# Altium project 超声波测距.PrjPCB
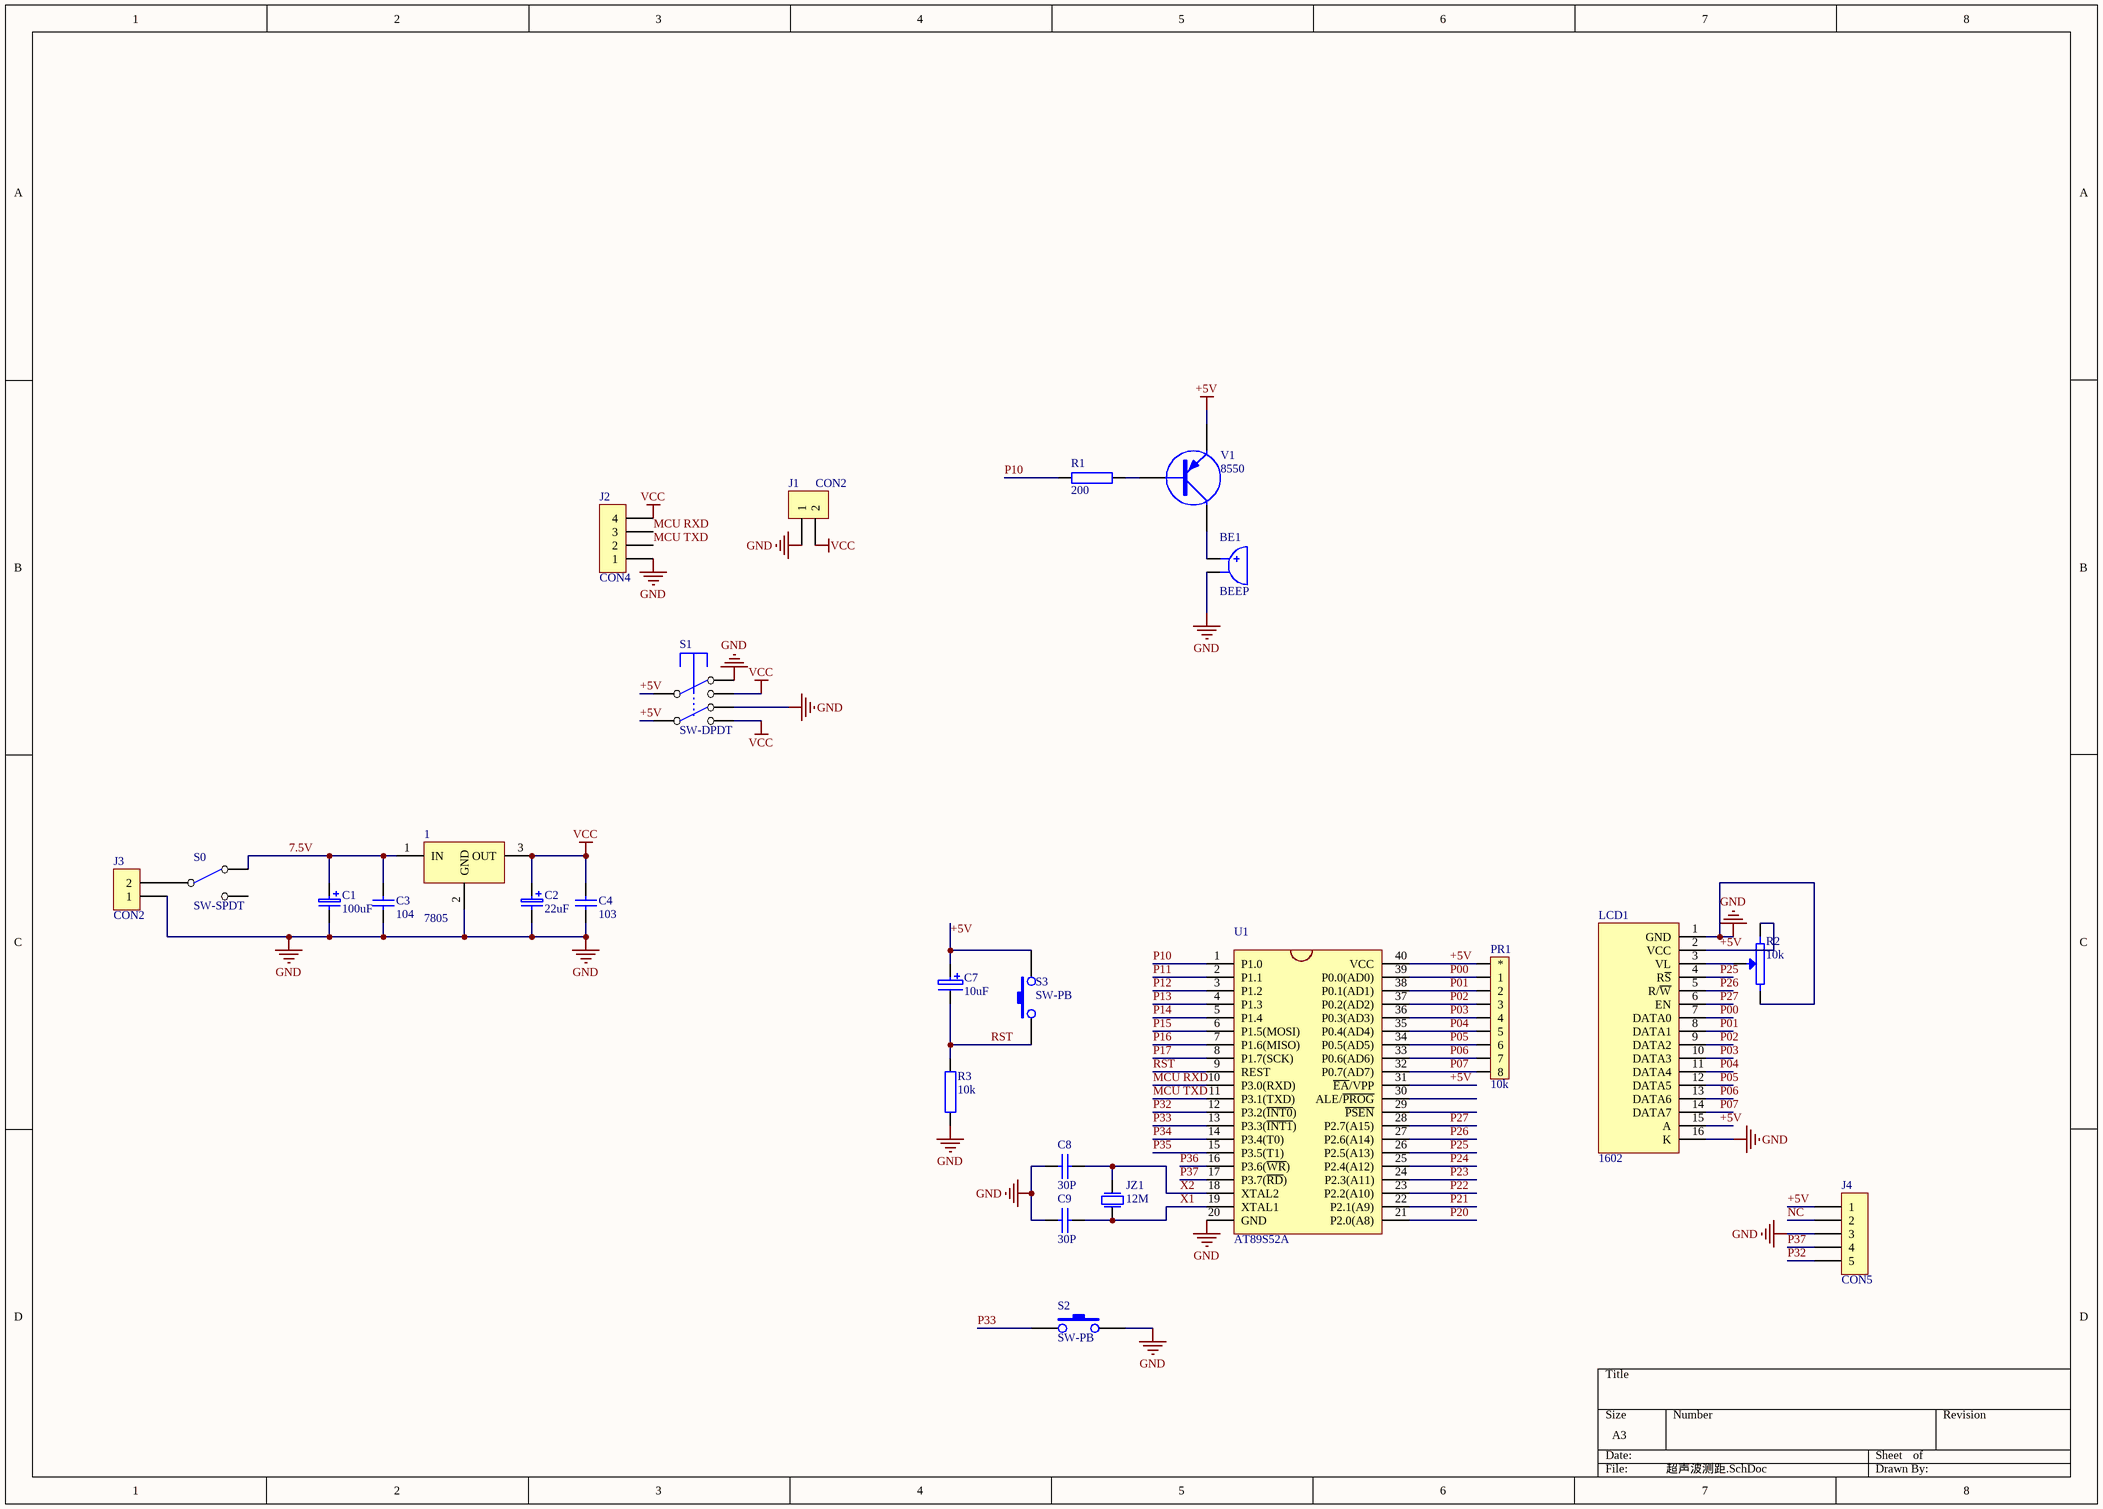
[diagram p0: 超声波测距.SchDoc]
1 sheet, 25 parts. Net scope: global (net labels, ports and power ports of the same name join across sheets).
Board file: 超声波测距.PcbDoc

## Sheet 超声波测距.SchDoc
size A3

### Parts
1  7805  [TO-220]
BE1  BEEP  [DB]
C1  100uF  [CAO2]
C2  22uF  [CAO1]
C3  104  [CAP1]
C4  103  [CAP1]
C7  10uF  [CAO1]
C8  30P  [CAP1]
C9  30P  [CAP1]
J1  CON2  [sip-2]
J2  CON4  [sip-4]
J3  CON2  [sip-2]
J4  CON5  [sip-5]
JZ1  12M  [JZ1]
LCD1  1602  [RZ1602]
PR1  10k  [RP1]
R1  200  [AXIAL0.3]
R2  10k  [RVR-5]
R3  10k  [AXIAL0.3]
S0  SW-SPDT  [SIP-3]
S1  SW-DPDT  [SW3]
S2  SW-PB  [SW6*6]
S3  SW-PB  [SW6*6]
U1  AT89S52A  [DIP-40]
V1  8550  [TO92a]

### Nets
+5V: C7.1 J4.1 LCD1.2(VCC) LCD1.15(A) PR1.1 R2.3 S1.2 S1.5 S3.2 U1.31(~{EA}/VPP) U1.40(VCC) V1.1(E)
GND: 1.2(GND) BE1.2(-) C1.2 C2.2 C3.1 C4.1 C8.2 C9.2 J1.1 J2.1 J3.1 J4.3 LCD1.1(GND) LCD1.16(K) R2.1 R3.1 S1.0 S1.3 S2.2 U1.20(GND)
VCC: 1.3(OUT) C2.1 C4.2 J1.2 J2.4 S1.1 S1.4
7.5V: 1.1(IN) C1.1 C3.2 S0.1
MCU RXD: J2.3 U1.10(P3.0(RXD))
MCU TXD: J2.2 U1.11(P3.1(TXD))
NC: J4.2
P00: LCD1.7(DATA0) PR1.2(1) U1.39(P0.0(AD0))
P01: LCD1.8(DATA1) PR1.3(2) U1.38(P0.1(AD1))
P02: LCD1.9(DATA2) PR1.4(3) U1.37(P0.2(AD2))
P03: LCD1.10(DATA3) PR1.5(4) U1.36(P0.3(AD3))
P04: LCD1.11(DATA4) PR1.6(5) U1.35(P0.4(AD4))
P05: LCD1.12(DATA5) PR1.7(6) U1.34(P0.5(AD5))
P06: LCD1.13(DATA6) PR1.8(7) U1.33(P0.6(AD6))
P07: LCD1.14(DATA7) PR1.9(8) U1.32(P0.7(AD7))
P10: R1.1 U1.1(P1.0)
P11: U1.2(P1.1)
P12: U1.3(P1.2)
P13: U1.4(P1.3)
P14: U1.5(P1.4)
P15: U1.6(P1.5(MOSI))
P16: U1.7(P1.6(MISO))
P17: U1.8(P1.7(SCK))
P20: U1.21(P2.0(A8))
P21: U1.22(P2.1(A9))
P22: U1.23(P2.2(A10))
P23: U1.24(P2.3(A11))
P24: U1.25(P2.4(A12))
P25: LCD1.4(R~{S}) U1.26(P2.5(A13))
P26: LCD1.5(R/~{W}) U1.27(P2.6(A14))
P27: LCD1.6(EN) U1.28(P2.7(A15))
P32: J4.5 U1.12(P3.2(~{INT0}))
P33: S2.1 U1.13(P3.3(~{INT1}))
P34: U1.14(P3.4(T0))
P35: U1.15(P3.5(T1))
P36: U1.16(P3.6(~{WR}))
P37: J4.4 U1.17(P3.7(~{RD}))
RST: C7.2 R3.2 S3.1 U1.9(REST)
X1: C9.1 JZ1.2(P2) U1.19(XTAL1)
X2: C8.1 JZ1.1(P1) U1.18(XTAL2)
NetBE1_1: BE1.1(+) V1.3(C)
NetJ3_2: J3.2 S0.2(c)
NetLCD1_3: LCD1.3(VL) R2.2(W)
NetR1_2: R1.2 V1.2(B)

Not connected (* = marked no-connect by the designer): S0 3; U1 29(~{PSEN}) 30(ALE/~{PROG})

### Library data of the parts
C1 C2 = Cap Pol1: Polarized Capacitor (Radial); Published: 8-Jun-2000; LatestRevisionDate: 17-Jul-2002; LatestRevisionNote: Re-released for DXP Platform.; PackageReference: RB7.6-15; Publisher: Altium Limited
C3 C4 = Cap: Capacitor; Published: 8-Jun-2000; LatestRevisionDate: 17-Jul-2002; LatestRevisionNote: Re-released for DXP Platform.; PackageReference: RAD-0.3; Publisher: Altium Limited
C7 = CAP3
C8 C9 = CAP1
J1 J3 = CON2: Connector
J2 = CON4: Connector
J4 = CON5: Connector
JZ1 = CRY1: 6.0000 8.000  11.0592  12.0000 24.000
PR1 = PRES1
R1 R3 = RES
R2 = RPOT-1: Potentiometer